# EasyEDA schematic SCH_ad7606明欣_2022-06-28.json
TITLE: Sheet_1; REV: 1.0; Date: 2022-05-21; Sheet: 1/1; Drawn By: Sarkura_Lws; Company: Your Company
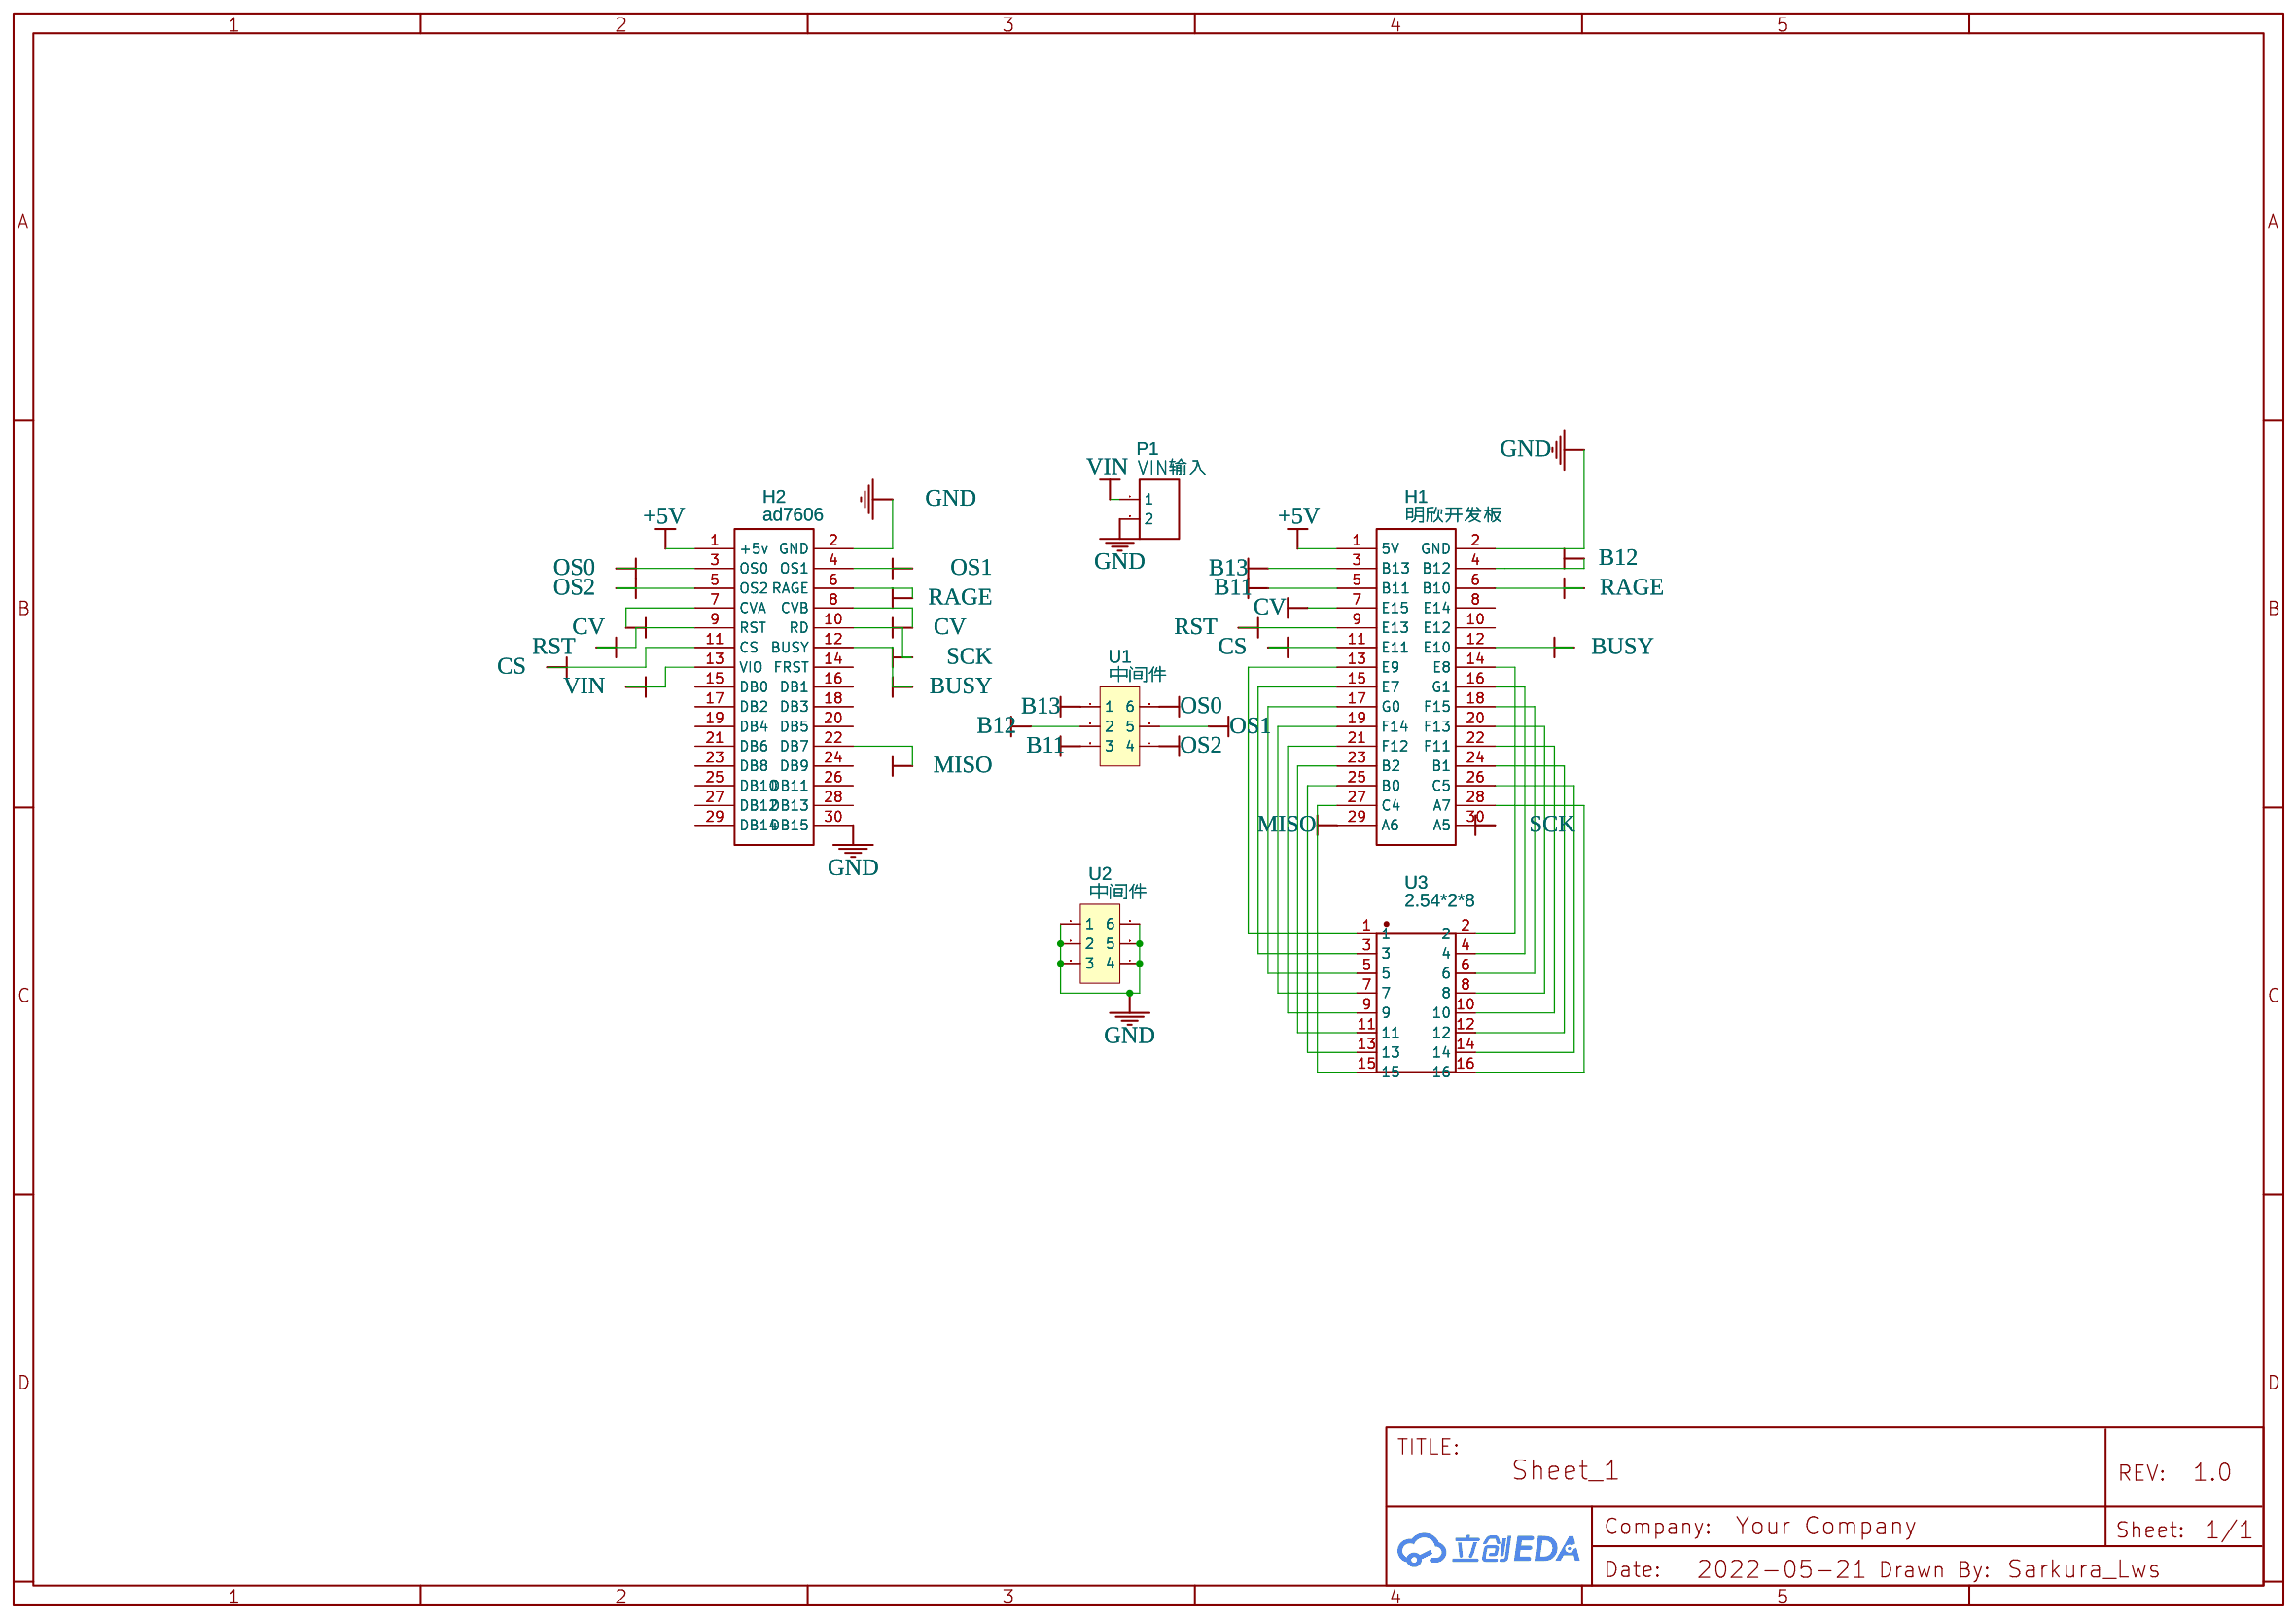
[diagram p0: schematic sheet]

## Parts
H1  明欣开发板  [HDR-TH_30P-P2.54-V-M-R2-C15-S2.54]
H2  ad7606  [HDR-TH_30P-P2.54-V-M-R2-C15-S2.54]
P1  VIN输入  [HDR-TH_2P-P2.54-V-F]
U1  中间件  [HEADER-2*3-2.54MM]
U2  中间件  [HEADER-2*3-2.54MM]
U3  2.54*2*8  [2.54*2*8P]

## Library data of the parts
H1 H2 = 2*15P 2.54mm: Supplier: LCSC; Supplier Part: C169817; Manufacturer: Shenzhen Cankemeng; Contributor: LCSC; JLCPCB Part Class: Extended Part
P1 = Header-Female-2.54_1x2: Supplier: LCSC; Manufacturer: BOOMELE; Manufacturer Part: 2.54-1*2PFemale; Supplier Part: C49661; JLCPCB Part Class: Extended Part
U1 U2 = HEADER-2*3-2.54MM: Contributor: oyxy
U3 = 2.54*2*8: Contributor: wanlingdu1234

## Nets
+5V: H1.1(5V) H2.1(+5v)
GND: H1.2(GND) H2.2(GND) H2.30(DB15) P1.2 U2.1 U2.2 U2.3 U2.4 U2.5 U2.6
VIN: H2.13(VIO) P1.1
B11: H1.5(B11) U1.3
B12: H1.4(B12) U1.2
B13: H1.3(B13) U1.1
BUSY: H1.12(E10) H2.12(BUSY)
CS: H1.11(E11) H2.11(CS)
CV: H1.7(E15) H2.7(CVA) H2.8(CVB)
MISO: H1.29(A6) H2.22(DB7)
OS0: H2.3(OS0) U1.6
OS1: H2.4(OS1) U1.5
OS2: H2.5(OS2) U1.4
RAGE: H1.6(B10) H2.6(RAGE)
RST: H1.9(E13) H2.9(RST)
SCK: H1.30(A5) H2.10(RD)
Net-(H1-13): H1.13(E9) U3.1
Net-(H1-14): H1.14(E8) U3.2
Net-(H1-15): H1.15(E7) U3.3
Net-(H1-16): H1.16(G1) U3.4
Net-(H1-17): H1.17(G0) U3.5
Net-(H1-18): H1.18(F15) U3.6
Net-(H1-19): H1.19(F14) U3.7
Net-(H1-20): H1.20(F13) U3.8
Net-(H1-21): H1.21(F12) U3.9
Net-(H1-22): H1.22(F11) U3.10
Net-(H1-23): H1.23(B2) U3.11
Net-(H1-24): H1.24(B1) U3.12
Net-(H1-25): H1.25(B0) U3.13
Net-(H1-26): H1.26(C5) U3.14
Net-(H1-27): H1.27(C4) U3.15
Net-(H1-28): H1.28(A7) U3.16

Not connected (* = marked no-connect by the designer): H1 8(E14) 10(E12); H2 14(FRST) 15(DB0) 16(DB1) 17(DB2) 18(DB3) 19(DB4) 20(DB5) 21(DB6) 23(DB8) 24(DB9) 25(DB10) 26(DB11) 27(DB12) 28(DB13) 29(DB14)
